# Altium schematic sheet embeddedSCH.SchDoc
size A; SheetNumber: 1; SheetTotal: 1
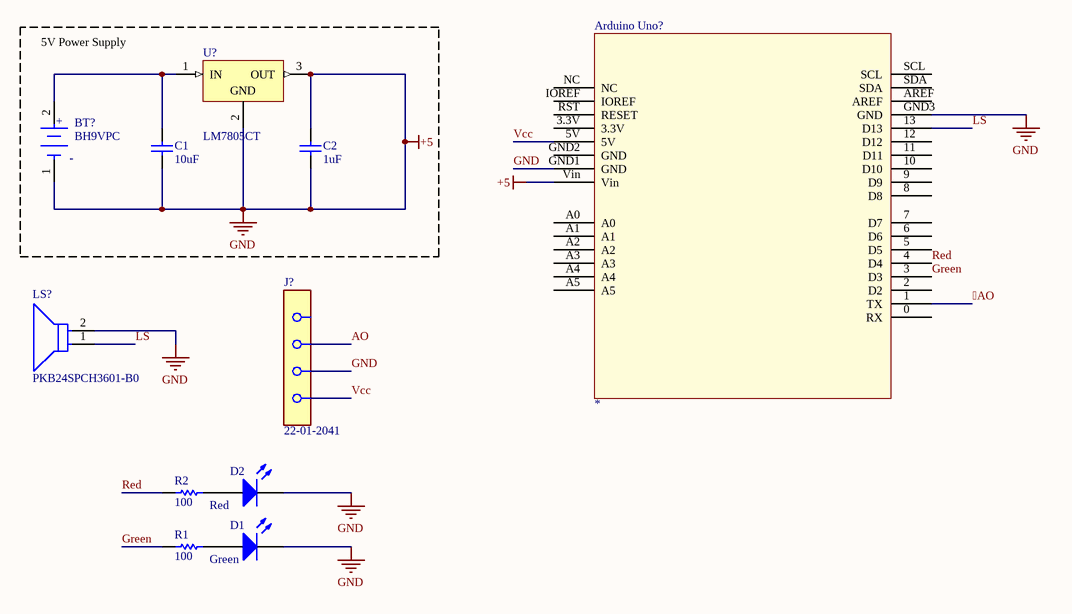
[diagram p0: embeddedSCH.SchDoc]

## Parts
Arduino_Uno?  *  [ARDUINO UNO]
BT?  BH9VPC  [FP-BH9VPC-MFG]
C1  value 10uF  (hidden comment: Capacitor)
C2  value 1uF  (hidden comment: Capacitor)
D1  Green
D2  Red
J?  22-01-2041  [FP-22-01-2041-MFG]
LS?  PKB24SPCH3601-B0  [FP-PKB24SPCH3601-B0-MFG]
R1  value 100  (hidden comment: Resistor)
R2  value 100  (hidden comment: Resistor)
U?  LM7805CT  [FAIR-TO-220-3]

## Nets
GND: Arduino_Uno?.GND1(GND) Arduino_Uno?.GND3(GND) Arduino_Uno?.Vin BT?.1(C) C1.2 C2.1 C2.2 D1.2(K) D2.2(K) LS?.2(A) U?.2(GND) U?.3(OUT)  [also labelled +5]
AO: Arduino_Uno?.1(TX)
Green: Arduino_Uno?.3(D3) R1.1
LS: Arduino_Uno?.13(D13) LS?.1(C)
Red: Arduino_Uno?.4(D4) R2.1
Vcc: Arduino_Uno?.5V
NetBT?_2: BT?.2(A) C1.1 U?.1(IN)
NetD1_1: D1.1(A) R1.2
NetD2_1: D2.1(A) R2.2

Not connected (* = marked no-connect by the designer): Arduino_Uno? 0(RX) 2(D2) 3.3V 5(D5) 6(D6) 7(D7) 8(D8) 9(D9) 10(D10) 11(D11) 12(D12) A0 A1 A2 A3 A4 A5 AREF GND2(GND) IOREF NC RST(RESET) SCL SDA

## Notes on the sheet
- 5V Power Supply
- (in symbol CMP-136216-000001-1) +; -

## Library data of the parts
Arduino_Uno? = ARDUINO UNO
BT? = CMP-136216-000001-1: BATTERY HOLDER 9V PC PIN; Manufacturer: Memory Protection Devices; Conn Orientation: Vertical; Is Female: yes; Number Of Contacts: 2; Device Class L2: unset; Contact Material: Nickel; Device Class L1: Connectors; Lead Free: Yes; Digikey Description: BATTERY HOLDER 9V PC PIN; Category: Batt; ComponentLink2URL: http://www.memoryprotectiondevices.com/datasheets/BH9VPC-datasheet.pdf; Device Class L3: unset; Package: 0; Automotive: No; ComponentLink2Description: Datasheet; Height: 21.12mm; Voltage Rating: 9V; Octopart: https://octopart.com/bh9vpc-memory+protection+devices-22788154; RoHS: TRUE; Manufacturer Part Number: BH9VPC
C1 C2 = Capacitor: SimulationGenericComponent: True
D1 D2 = LED: Light-Emitting Diode; AF: 1; BV: 0; BV_MAX: 1e99; EG: 1.11; FC: 0.5; IBV: 0.001; IS: 1e-14; MJSW: 0.33; NTUN: 30; TNOM: 27; XTI: 3; SimulationGenericComponent: True; CJO: 0; CJP: 0; CTA: 0; CTP: 0; FCS: 0.5; FV_MAX: 1e99; IKF: 0; IKR: 0; ISR: 1e-14; JSW: 0; JTUN: 0; JTUNSW: 0; KEG: 1; KF: 0; LEVEL: 1; N: 1; NBV: 1; NR: 1; NS: 1; PHP: 1; RS: 0; TCV: 0; TLEV: 0; TLEVC: 0; TM1: 0; TM2: 0; TPB: 0; TPHP: 0; TRS: 0; TRS2: 0; TT: 0; TTT1: 0; TTT2: 0; VJ: 1; XTITUN: 3
J? = CMP-04776-000446-1: CONN HOUSING 4POS .100 W/O RAMP; Approvals: UL; Number of Positions: 4; Voltage Rating: 250V; Max Current Rating: 4A; Glow Wire Compliant: Non-compliant; Pitch: 2.54mm; Gender: Female; Connector Type: Receptacle; Length: 10.72mm; Number of Circuits: 4; Contact Gender: Female; Contact Material: Bronze; Packaging: Bulk; Package Quantity: 1; Series: KK® 2695; Halogen Free: Low Halogen; Flammability Rating: UL94 V-0; Depth: 12.7mm; Orientation: Straight; Mount: Free Hanging; Lead Free: Lead Free; Housing Material: Nylon; Contact Type: Non Gendered; Number of Rows: 1; Max Operating Temperature: 75°C; Housing Color: White; Height: 4.82mm; Number of Contacts: 4; Termination: Crimp; Radiation Hardening: No; Color: White; Width: 4.82mm; Min Operating Temperature: 0°C
LS? = CMP-06203-000001-2: AUDIO PIEZO TRANSDUCER 3-15V TH; Self Resonant Frequency: 3.6kHz; Voltage Rating (DC): 15V; Min Supply Voltage: 3V; Operating Supply Current: 16mA; Voltage Rating: 12V; Max Frequency: 4.1kHz; Washable: No; REACH SVHC: No SVHC; Packaging: Bulk; Frequency: 3.6kHz; Max Operating Temperature: 70°C; Max Supply Voltage: 15V; Max Supply Voltage (DC): 15V; Diameter: 24.3mm; Lead Free: Lead Free; Radiation Hardening: No; Nominal Supply Current: 16mA; Height: 9.7mm; Mount: Flush; Nominal Supply Voltage (DC): 12V; Min Operating Temperature: -20°C; Termination: PC Pins; Length: 24.3mm; Package Quantity: 650; Min Supply Voltage (DC): 3V; Max Supply Current: 16mA
R1 R2 = Resistor: TC1: 0; SimulationGenericComponent: True; TC2: 0
U? = CMP-2000-04938-1: Positive Voltage Regulator, 5 V, 1 A, -40 to 125 degC, 3-Pin TO-220, RoHS, Tube; Manufacturer: FairchildSemiconductor; Maximum Input Voltage: 35V; Maximum Quiescent Current: 8mA; Load Regulation: 100mV; Maximum Output Current: 2.2(Typ)A; Output Type: Fixed; Typical Dropout Voltage @ Current: 2@1AV; Rad Hard: No; Output Voltage: 5V; Accuracy: ±4%; Number of Outputs: 1; Category: LinearRegulator; Package Description: 3-Pin Through Hole Device, Body 10 x 4.5 mm, Pitch 2.54 mm; Packaging: Rail/Tube; Mounting: ThroughHole; Polarity: Positive; Manufacturer URL: https://www.fairchildsemi.com/; Line Regulation: 100mV; Datasheet Version: Aug-12; Datasheet URL: https://datasheet.ciiva.com/26904/lm7805ct-26904988.pdf; Package Reference: TO-220; Package URL: https://www.fairchildsemi.com/package-drawings/TO/TO220B03.pdf; Package: 3TO-220AB; Operating Temperature: -40to125degC; Type: Linear